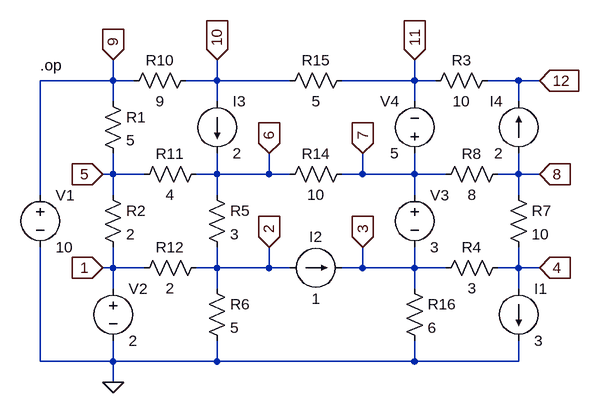
[diagram p0: schematic test_2.asc]
test_2.asc, the LTspice schematic file:
Version 4
SHEET 1 896 680
WIRE 80 0 80 -32
WIRE 80 0 -32 0
WIRE 112 0 80 0
WIRE 240 0 240 -32
WIRE 240 0 192 0
WIRE 352 0 240 0
WIRE 544 0 544 -32
WIRE 544 0 432 0
WIRE 576 0 544 0
WIRE 704 0 656 0
WIRE 736 0 704 0
WIRE 80 32 80 0
WIRE 240 32 240 0
WIRE 544 32 544 0
WIRE 704 32 704 0
WIRE 80 144 80 112
WIRE 80 144 64 144
WIRE 128 144 80 144
WIRE 240 144 240 112
WIRE 240 144 208 144
WIRE 320 144 320 112
WIRE 320 144 240 144
WIRE 352 144 320 144
WIRE 464 144 464 112
WIRE 464 144 432 144
WIRE 544 144 544 112
WIRE 544 144 464 144
WIRE 592 144 544 144
WIRE 704 144 704 112
WIRE 704 144 672 144
WIRE 736 144 704 144
WIRE -32 176 -32 0
WIRE 80 176 80 144
WIRE 240 176 240 144
WIRE 544 176 544 144
WIRE 704 176 704 144
WIRE 80 288 80 256
WIRE 80 288 64 288
WIRE 128 288 80 288
WIRE 240 288 240 256
WIRE 240 288 208 288
WIRE 320 288 320 256
WIRE 320 288 240 288
WIRE 352 288 320 288
WIRE 464 288 464 256
WIRE 464 288 432 288
WIRE 544 288 544 256
WIRE 544 288 464 288
WIRE 592 288 544 288
WIRE 704 288 704 256
WIRE 704 288 672 288
WIRE 736 288 704 288
WIRE 80 320 80 288
WIRE 240 320 240 288
WIRE 544 320 544 288
WIRE 704 320 704 288
WIRE -32 432 -32 256
WIRE 80 432 80 400
WIRE 80 432 -32 432
WIRE 240 432 240 400
WIRE 240 432 80 432
WIRE 544 432 544 400
WIRE 544 432 240 432
WIRE 704 432 704 400
WIRE 704 432 544 432
WIRE 80 464 80 432
FLAG 80 464 0
FLAG 64 288 1
IOPIN 64 288 In
FLAG 64 144 5
IOPIN 64 144 In
FLAG 80 -32 9
IOPIN 80 -32 In
FLAG 240 -32 10
IOPIN 240 -32 In
FLAG 544 -32 11
IOPIN 544 -32 In
FLAG 736 0 12
IOPIN 736 0 In
FLAG 736 144 8
IOPIN 736 144 In
FLAG 736 288 4
IOPIN 736 288 In
FLAG 464 112 7
IOPIN 464 112 In
FLAG 464 256 3
IOPIN 464 256 In
FLAG 320 112 6
IOPIN 320 112 In
FLAG 320 256 2
IOPIN 320 256 In
SYMBOL res 64 16 R0
SYMATTR InstName R1
SYMATTR Value 5
SYMBOL res 64 160 R0
SYMATTR InstName R2
SYMATTR Value 2
SYMBOL res 224 160 R0
SYMATTR InstName R5
SYMATTR Value 3
SYMBOL res 224 304 R0
SYMATTR InstName R6
SYMATTR Value 5
SYMBOL res 688 128 R90
WINDOW 0 0 56 VBottom 2
WINDOW 3 32 56 VTop 2
SYMATTR InstName R8
SYMATTR Value 8
SYMBOL res 208 -16 R90
WINDOW 0 0 56 VBottom 2
WINDOW 3 32 56 VTop 2
SYMATTR InstName R10
SYMATTR Value 9
SYMBOL res 224 128 R90
WINDOW 0 0 56 VBottom 2
WINDOW 3 32 56 VTop 2
SYMATTR InstName R11
SYMATTR Value 4
SYMBOL res 224 272 R90
WINDOW 0 0 56 VBottom 2
WINDOW 3 32 56 VTop 2
SYMATTR InstName R12
SYMATTR Value 2
SYMBOL res 448 128 R90
WINDOW 0 0 56 VBottom 2
WINDOW 3 32 56 VTop 2
SYMATTR InstName R14
SYMATTR Value 10
SYMBOL res 448 -16 R90
WINDOW 0 0 56 VBottom 2
WINDOW 3 32 56 VTop 2
SYMATTR InstName R15
SYMATTR Value 5
SYMBOL voltage -32 160 R0
WINDOW 123 0 0 Left 2
WINDOW 39 0 0 Left 2
SYMATTR InstName V1
SYMATTR Value 10
SYMBOL voltage 80 304 R0
WINDOW 123 0 0 Left 2
WINDOW 39 0 0 Left 2
SYMATTR InstName V2
SYMATTR Value 2
SYMBOL voltage 544 160 R0
WINDOW 123 0 0 Left 2
WINDOW 39 0 0 Left 2
SYMATTR InstName V3
SYMATTR Value 3
SYMBOL voltage 544 128 R180
WINDOW 0 24 96 Left 2
WINDOW 3 24 16 Left 2
WINDOW 123 0 0 Left 2
WINDOW 39 0 0 Left 2
SYMATTR InstName V4
SYMATTR Value 5
SYMBOL current 704 320 R0
WINDOW 123 0 0 Left 2
WINDOW 39 0 0 Left 2
SYMATTR InstName I1
SYMATTR Value 3
SYMBOL current 352 288 R270
WINDOW 0 32 40 VTop 2
WINDOW 3 -32 40 VBottom 2
WINDOW 123 0 0 Left 2
WINDOW 39 0 0 Left 2
SYMATTR InstName I2
SYMATTR Value 1
SYMBOL current 240 32 R0
WINDOW 123 0 0 Left 2
WINDOW 39 0 0 Left 2
SYMATTR InstName I3
SYMATTR Value 2
SYMBOL current 704 112 R180
WINDOW 0 24 80 Left 2
WINDOW 3 24 0 Left 2
WINDOW 123 0 0 Left 2
WINDOW 39 0 0 Left 2
SYMATTR InstName I4
SYMATTR Value 2
SYMBOL res 688 160 R0
SYMATTR InstName R7
SYMATTR Value 10
SYMBOL res 528 304 R0
SYMATTR InstName R16
SYMATTR Value 6
SYMBOL res 672 -16 R90
WINDOW 0 0 56 VBottom 2
WINDOW 3 32 56 VTop 2
SYMATTR InstName R3
SYMATTR Value 10
SYMBOL res 688 272 R90
WINDOW 0 0 56 VBottom 2
WINDOW 3 32 56 VTop 2
SYMATTR InstName R4
SYMATTR Value 3
TEXT -32 -24 Left 2 !.op

The netlist it stands for:
* test_2.asc
R1 9 5 5
R2 5 1 2
R5 6 2 3
R6 2 0 5
R8 8 7 8
R10 10 9 9
R11 6 5 4
R12 2 1 2
R14 7 6 10
R15 11 10 5
V1 9 0 10
V2 1 0 2
V3 7 3 3
V4 7 11 5
I1 4 0 3
I2 2 3 1
I3 10 6 2
I4 8 12 2
R7 8 4 10
R16 3 0 6
R3 12 11 10
R4 4 3 3
.op
.backanno
.end